# EAGLE design g5gate-wroom (EAGLE 9.6.2)
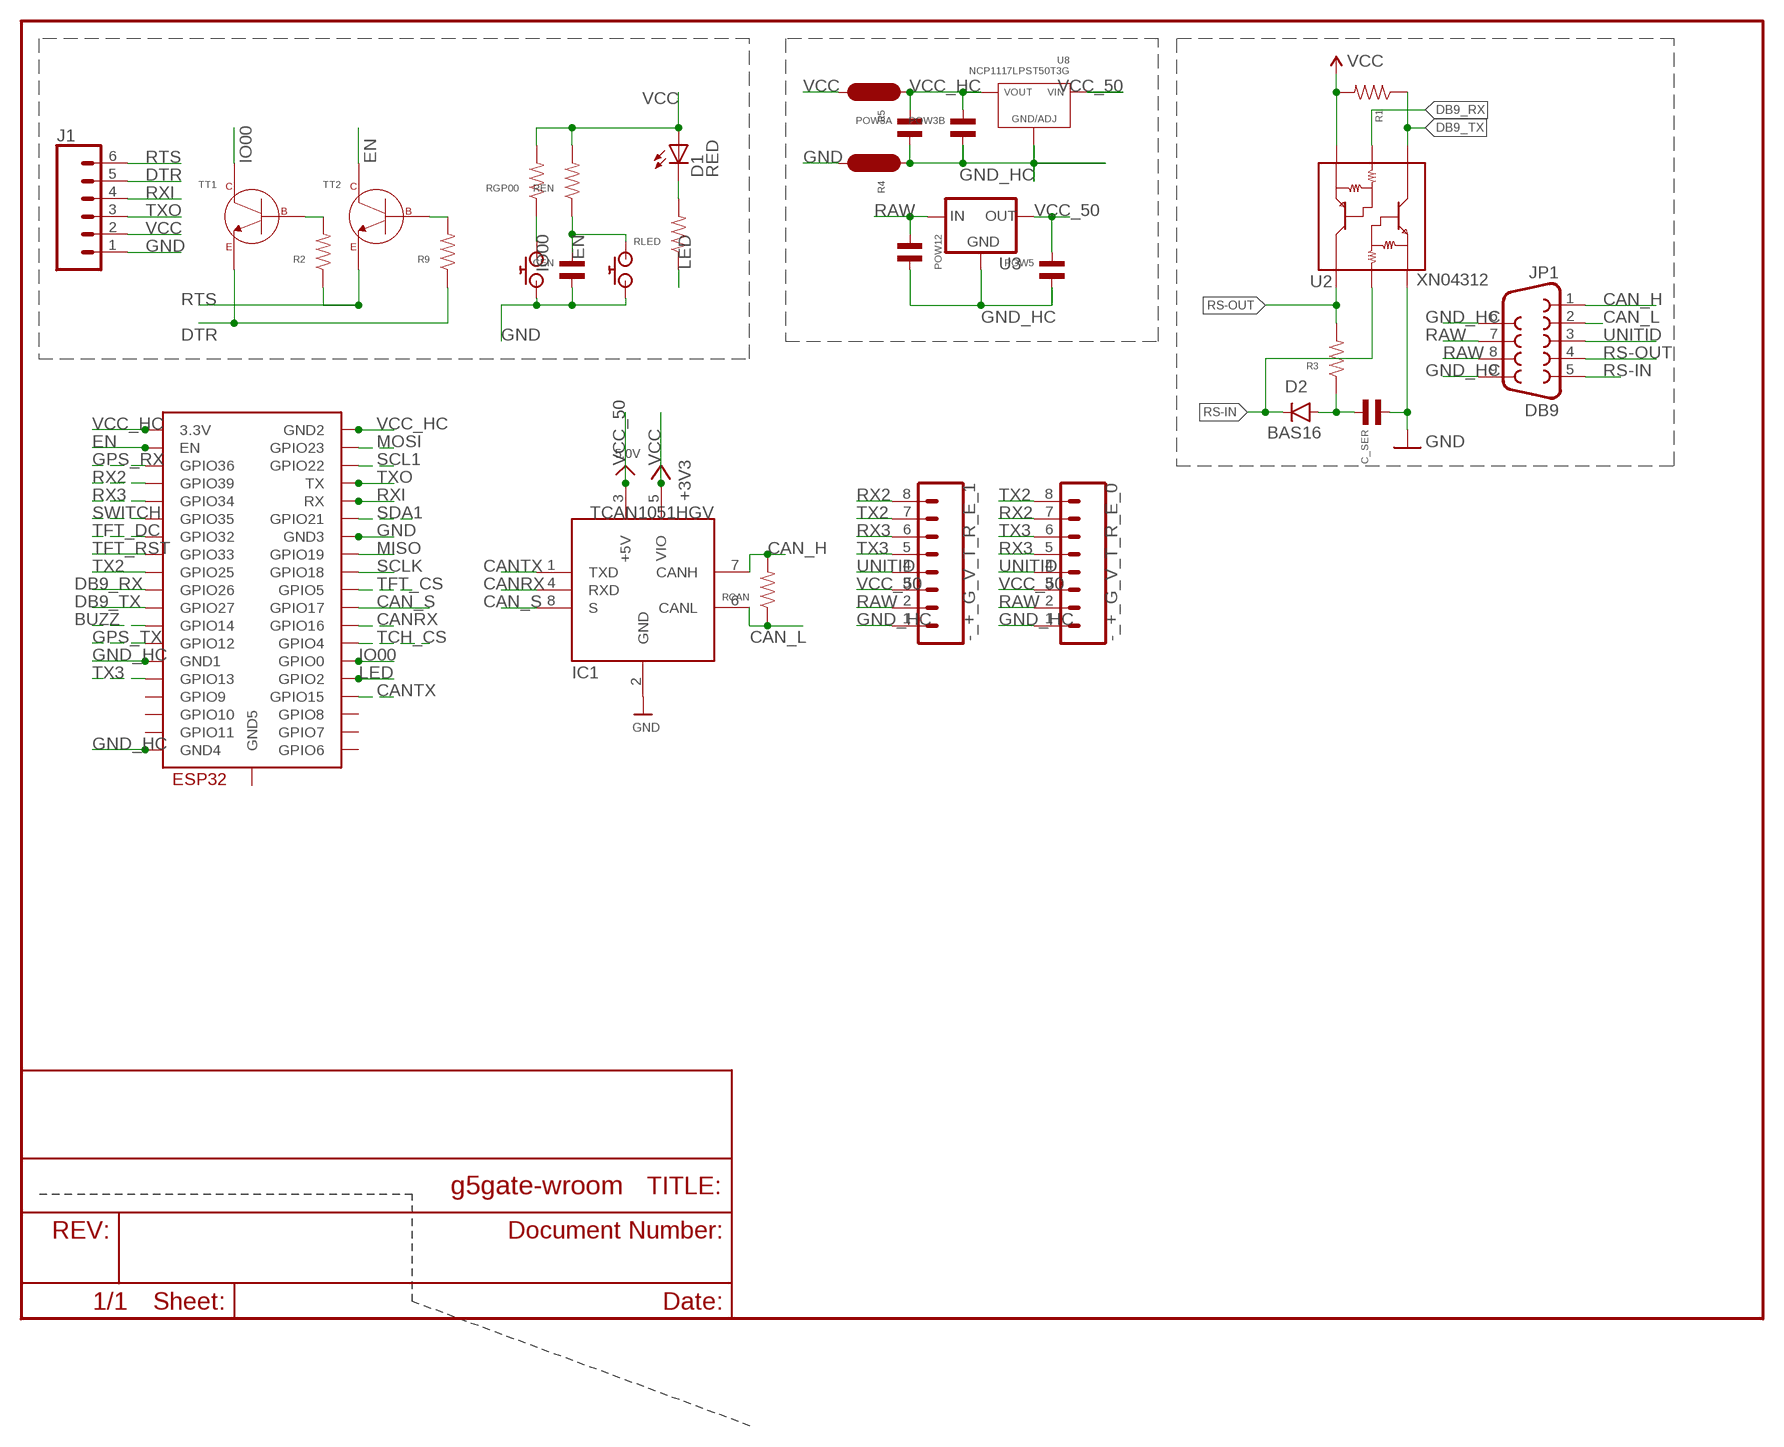
[diagram p0: schematic, sheet 1]

## Parts
-_+_G_V_T_R_E_0  MF-CON-2.54mm-01x08  M081X08  [1X08]
-_+_G_V_T_R_E_1  MF-CON-2.54mm-01x08  M081X08  [1X08]
C_SER  CAPACITOR_NP_0603  [C0603]
CEN  CAPACITOR_NP_0603  [C0603]
D1  RED  LED-RED0603  [LED-0603]
D2  BAS16  DIODEBAS16  [SOD-323]
IC1  TCAN1051HGV  CAN_TRANSCIEVER_TCAN1051V  [SOIC8_150MIL]
J1  CONN_06  [1X6-1.25MM-SMD]
JP1  DB9  DB9FEMALE  [DB9]
POW3A  CAPACITOR_NP_0603  [C0603]
POW3B  CAPACITOR_NP_0603  [C0603]
POW5  CAPACITOR_NP_0603  [C0603]
POW12  CAPACITOR_NP_0603  [C0603]
R1  RESISTOR_0603  [R0603]
R2  RESISTOR_0603  [R0603]
R3  RESISTOR_0603  [R0603]
R4  JUMPER  [R0603_JMP]
R5  JUMPER  [R0603_JMP]
R9  RESISTOR_0603  [R0603]
RCAN  RESISTOR_0603  [R0603]
REN  RESISTOR_0603  [R0603]
RGP00  RESISTOR_0603  [R0603]
RLED  RESISTOR_0603  [R0603]
TT1  MF-DSC-SOT233-MMBT3904  NPN_BJTMMBT3904_SOT-23-3  [SOT-23-3]
TT2  MF-DSC-SOT233-MMBT3904  NPN_BJTMMBT3904_SOT-23-3  [SOT-23-3]
U2  XN04312  XN04312SOT  [SOT23-6]
U3  V_REG_78XXSINK  [TO220-IGO]
U8  NCP1117LPST50T3G  [SOT-223-3]
U$1  AMAZON_BUTTONB2010  [C2010]
U$2  AMAZON_BUTTONB2010  [C2010]
U$3  ESP32-WROOM  [ESP32-WROOM]

## Nets
BUZZ: U$3.IO14(GPIO14)
CAN_H: IC1.7(CANH) JP1.1 RCAN.P$2
CAN_L: IC1.6(CANL) JP1.2 RCAN.P$1
CAN_S: IC1.8(S) U$3.IO17(GPIO17)
CANRX: IC1.4(RXD) U$3.IO16(GPIO16)
CANTX: IC1.1(TXD) U$3.IO15(GPIO15)
DB9_RX: U2.2(B2) U$3.IO26(GPIO26)
DB9_TX: R1.P$1 U2.1(C1) U$3.IO27(GPIO27)
DTR: J1.5 R9.P$1 TT1.P$2(EMITTER)
EN: CEN.P$1 REN.P$1 TT2.P$3(COLLECTOR) U$2.P$1 U$3.EN
GND: C_SER.P$2 CEN.P$2 IC1.2(GND) J1.1 R4.P$2 U2.6(E1) U$1.P$2 U$2.P$2 U$3.GND3
GND_HC [hc]: -_+_G_V_T_R_E_0.1 -_+_G_V_T_R_E_1.1 JP1.6 JP1.9 POW3A.P$2 POW3B.P$2 POW5.P$2 POW12.P$2 R4.P$1 U3.GND U8.P$2(GND/ADJ) U$3.GND1 U$3.GND4
GPS_RX: U$3.SENSOR_VP(GPIO36)
GPS_TX: U$3.IO12(GPIO12)
IO00: RGP00.P$1 TT1.P$3(COLLECTOR) U$1.P$1 U$3.IO0(GPIO0)
LED: RLED.P$1 U$3.IO2(GPIO2)
MISO: U$3.IO19(GPIO19)
MOSI: U$3.IO23(GPIO23)
N$2: D1.C RLED.P$2
N$3: R2.P$2 TT1.P$1(BASE)
N$4: C_SER.P$1 D2.A R3.P$1
N$6: R9.P$2 TT2.P$1(BASE)
RAW [hc]: -_+_G_V_T_R_E_0.2 -_+_G_V_T_R_E_1.2 JP1.7 JP1.8 POW12.P$1 U3.IN
RS-IN: D2.C JP1.5 U2.5(B1)
RS-OUT: JP1.4 R3.P$2 U2.4(C2)
RTS: J1.6 R2.P$1 TT2.P$2(EMITTER)
RX2: -_+_G_V_T_R_E_0.7 -_+_G_V_T_R_E_1.8 U$3.SENSOR_VN(GPIO39)
RX3: -_+_G_V_T_R_E_0.5 -_+_G_V_T_R_E_1.6 U$3.IO34(GPIO34)
RXI: J1.4 U$3.RX
SCL1: U$3.IO22(GPIO22)
SCLK: U$3.IO18(GPIO18)
SDA1: U$3.IO21(GPIO21)
SWITCH: U$3.IO35(GPIO35)
TCH_CS: U$3.IO4(GPIO4)
TFT_CS: U$3.IO5(GPIO5)
TFT_DC: U$3.IO32(GPIO32)
TFT_RST: U$3.IO33(GPIO33)
TX2: -_+_G_V_T_R_E_0.8 -_+_G_V_T_R_E_1.7 U$3.IO25(GPIO25)
TX3: -_+_G_V_T_R_E_0.6 -_+_G_V_T_R_E_1.5 U$3.IO13(GPIO13)
TXO: J1.3 U$3.TX
UNITID: -_+_G_V_T_R_E_0.4 -_+_G_V_T_R_E_1.4 JP1.3
VCC: D1.A IC1.5(VIO) J1.2 R1.P$2 R5.P$2 REN.P$2 RGP00.P$2 U2.3(E2) ; supply symbol labelled +3V3
VCC_50 [hc]: -_+_G_V_T_R_E_0.3 -_+_G_V_T_R_E_1.3 IC1.3(+5V) POW5.P$1 U3.OUT U8.P$4(VIN) ; supply symbol labelled 5.0V
VCC_HC [hc]: POW3A.P$1 POW3B.P$1 R5.P$1 U8.P$1(VOUT) U8.P$3(VOUT) U$3.3V3(3.3V) U$3.GND2
Unconnected: U$3.CLK(GPIO6) U$3.CMD(GPIO11) U$3.GND5 U$3.SD0(GPIO7) U$3.SD1(GPIO8) U$3.SD2(GPIO9) U$3.SD3(GPIO10)

## Library data of the parts
-_+_G_V_T_R_E_0 -_+_G_V_T_R_E_1 = SparkFun-Connectors:M08: Header 8 Standard 8-pin 0.1" header. Use with straight break away headers (SKU : PRT-00116), right angle break away headers (PRT-00553), swiss pins (PRT-00743), machine pins (PRT-00117), and female headers (PRT-00115).
C_SER CEN POW3A POW3B POW5 POW12 = MF_Passives:CAPACITOR_NP: Library: MF_Passives Description: Device for Non-Polarized Capacitors. Manufacture part number (MPN) can be added via Attributes. Check https://factory.macrofab.com/parts for the house parts list.; POPULATE: 1
D1 = 00jim:LED-RED: Assorted Red LEDs LilyPad 1206- DIO-09912 1206- DIO-00809 0603- DIO-00819; PROD_ID: DIO-00819
D2 = SparkFun-DiscreteSemi:DIODE: Diode These are standard reverse protection diodes and small signal diodes. SMA package can handle up to about 1A. SOD-323 can handle about 200mA. What the SOD-323 package when ordering, there are some mfgs out there that are 5-pin packages.; PROD_ID: DIO-09646; VALUE: 250mA/100V
IC1 = microbuilder:CAN_TRANSCIEVER
J1 = 00jim:CONN_06: Multi connection point. Often used as Generic Header-pin footprint for 0.1 inch spaced/style header connections On any of the 0.1 inch spaced packages, you can populate with these: Break Away Headers - Straight <https://www.sparkfun.com/products/116> (PRT-00116) Break Away Male Headers - Right Angle <https://www.sparkfun.com/products/553> (PRT-00553) Female Headers <https://www.sparkfun.com/products/115> (PRT-00115) Break Away Headers - Machine Pin <https://www.sparkfun.com/products/117> (PRT-00117) Break Away Female Headers - Swiss Machine Pin <https://www.sparkfun.com/products/743> (PRT-00743) Arduino Stackable Header - 6 Pin <https://www.sparkfun.com/products/9280> (PRT-09280) For SCREWTERMINALS and SPRING TERMINALS visit here: Screw Terimnals on SparkFun.com <https://www.sparkfun.com/search/results?term=Screw+Terminals> (5mm/3.5mm/2.54mm spacing) This device is also useful as a general connection point to wire up your design to another part of your project. Our various solder wires solder well into these plated through hole pads. Hook-Up Wire - Assortment (Stranded, 22 AWG) <https://www.sparkfun.com/products/11375> (PRT-11375) Hook-Up Wire - Assortment (Solid Core, 22 AWG) <https://www.sparkfun.com/products/11367> (PRT-11367) View the entire wire category on our website here <https://www.sparkfun.com/categories/141>
JP1 = SparkFun-Connectors:DB9: DB9 Connector Standard DB9 (D-Sub 9) serial connector. Can be used for CAN bus as well as RS485 and RS232. Footprint production proven. Spark Fun Electronics SKU : PRT-00429; PROD_ID: CONN-08194
R1-R3 R9 RCAN REN RGP00 RLED = 00jim:RESISTOR: Library: MF_Passives Description: Device for Resistors. Manufacture part number (MPN), Voltage, Tolerance, and Wattage Rating can be added via Attributes. Check https://factory.macrofab.com/parts for the house parts list.; POPULATE: 1
R4 R5 = 00jim:JUMPER: Library: MF_Passives Description: Device for Resistors. Manufacture part number (MPN), Voltage, Tolerance, and Wattage Rating can be added via Attributes. Check https://factory.macrofab.com/parts for the house parts list.
TT1 TT2 = MF_Discrete_Semiconductor:NPN_BJT: Library: MF_Discrete_Semiconductor Description: Device for Single NPN BJT Transistors. Manufacture part number (MFG#) can be added via Attributes.; HOUSEPART: YES; MPN: MF-DSC-SOT233-MMBT3904; POPULATE: 1; URL: https://factory.macrofab.com/part/MF-DSC-SOT233-MMBT3904
U2 = SparkFun-DiscreteSemi:XN04312: NPN/PNP Transistor Array Handy dandy transistor array for level shifting and inverting signals. Spark Fun Electronics SKU : COM-00588; PROD_ID: TRANS-00816
U3 = SparkFun-IC-Power:V_REG_78XX: Voltage Regulator Standard 78xx regulator. IGO (Input Ground Output). Spark Fun Electronics SKU : COM-00107
U8 = MF_IC_Power:NCP1117LP: Manufacturer Part #: NCP1117LP Manufacturer: ON Semiconductor Description: LDO Voltage Regulators; HOUSEPART: NO; MPN: NCP1117LPST50T3G; POPULATE: 1; URL: http://www.onsemi.com/pub_link/Collateral/NCP1117LP-D.PDF
U$1 U$2 = 00jim:AMAZON_BUTTON
U$3 = ESP32:ESP32-WROOM

## Net classes
0 default: width 0.229 mm
1 vcc: width 0.254 mm
3 hc: width 0.508 mm

## Board
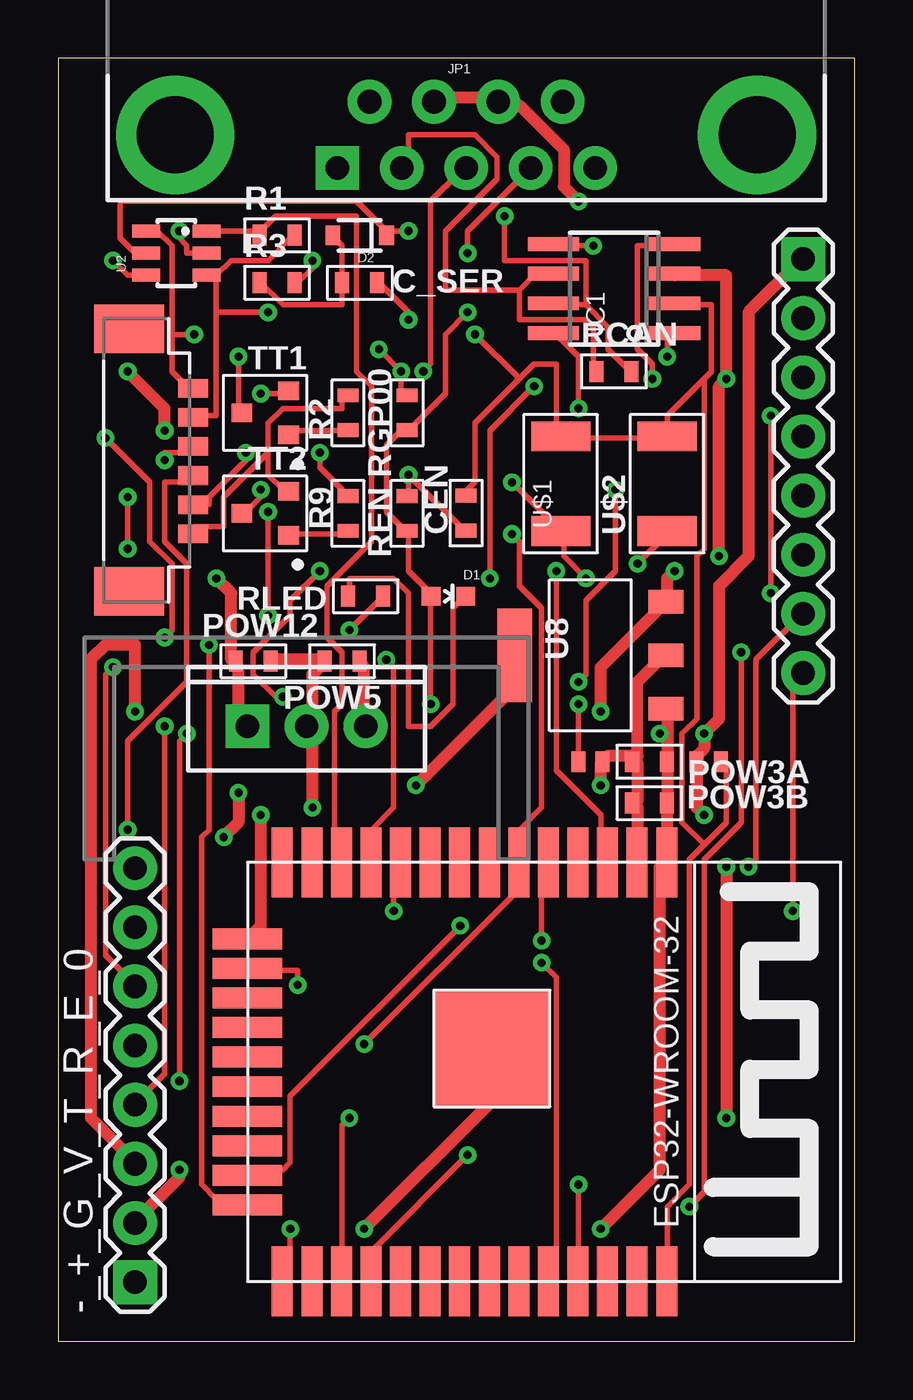
[diagram p1: board, top side]
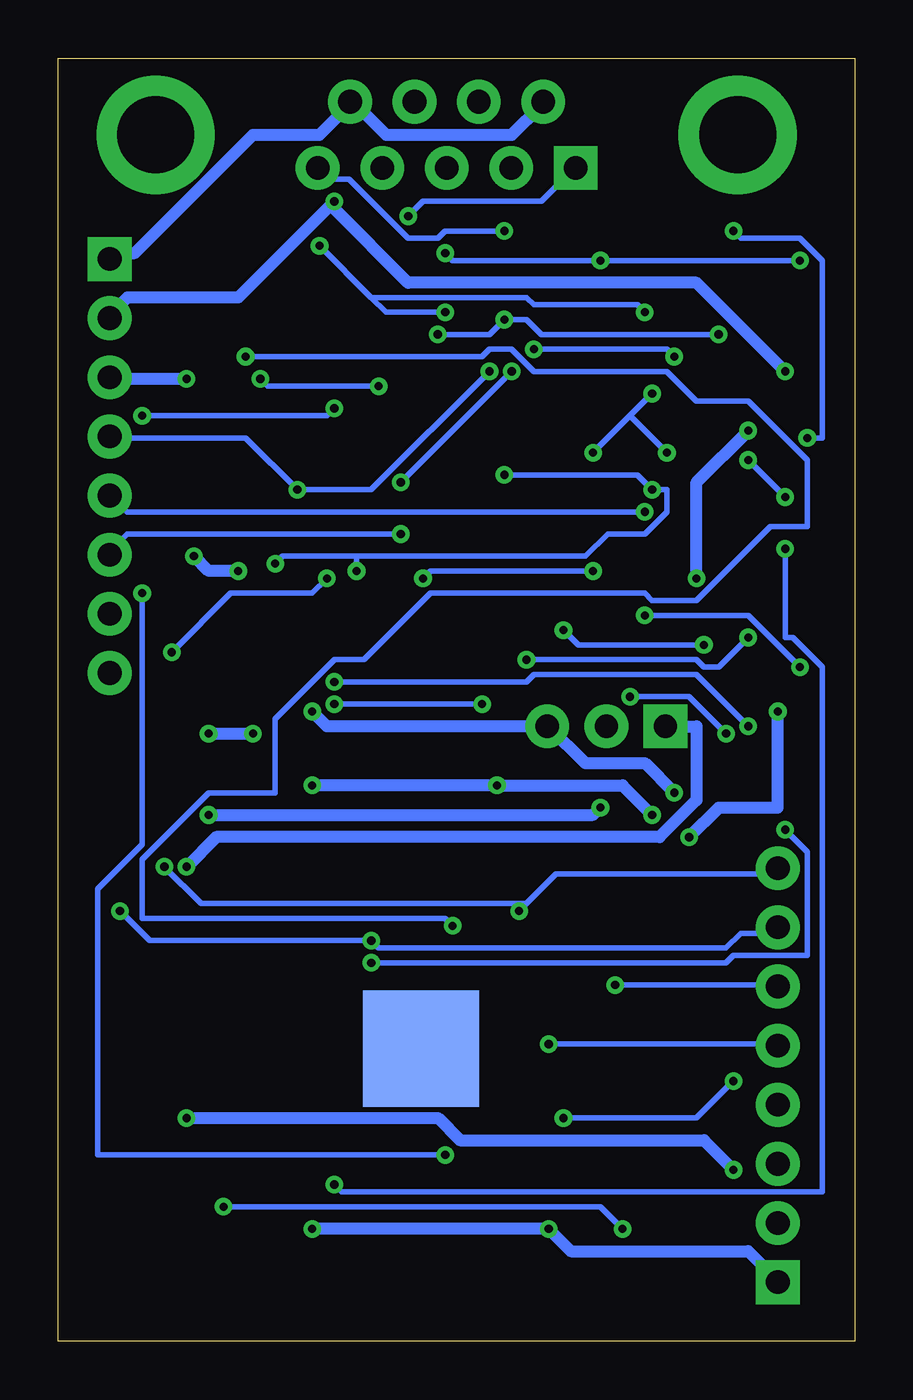
[diagram p2: board, bottom side, seen from below]

Size 34.21 x 55.11 mm. Coordinates in mm from the lower left corner, seen from the top.
Outline: 0,0 34.21,0 34.21,55.11 0,55.11 0,0
Copper layers (1*16): Top 0.035mm / dielectric 1.5mm / Bottom 0.035mm
Design rules "default *": minimum track width 6mil, minimum drill 0.35mm, track to track 6mil, track to pad 6mil, pad to pad 6mil, via to via 6mil, smd to smd 6mil, copper to edge 40mil, drill to drill 6mil, minimum pad ring 10mil, minimum via ring 8mil, stop-mask expansion 4mil, vias tented up to drill 30mil, thermal gap 10mil

### Footprints (pad centres in the part's own frame; a part is rotated, then mirrored left to right if it is on the bottom)
1X08 = drill 1.016 pad 1.88 square: 1 0,0 | drill 1.016 pad 1.88: 2 2.54,0; 3 5.08,0; 4 7.62,0; 5 10.16,0; 6 12.7,0; 7 15.24,0; 8 17.78,0
C0603 = smd 0.6 x 0.9: P$1 -0.75,0; P$2 0.75,0
LED-0603 = smd 0.8 x 0.8: A 0,-0.75; C 0,0.75
SOD-323 = smd 0.63 x 0.83: A 1.15,0; C -1.15,0
SOIC8_150MIL = smd 0.6 x 2.2: 1 -1.905,-2.6; 2 -0.635,-2.6; 3 0.635,-2.6; 4 1.905,-2.6; 5 1.905,2.6; 6 0.635,2.6; 7 -0.635,2.6; 8 -1.905,2.6
1X6-1.25MM-SMD = smd 0.8 x 1.3: 1 -3.085,1.48; 2 -1.835,1.48; 3 -0.585,1.48; 4 0.665,1.48; 5 1.915,1.48; 6 3.165,1.48 | smd 2.1 x 3: NC1 -5.635,-1.27; NC2 5.635,-1.27
DB9 = drill 1.016 pad 1.88 square: 1 -5.54,-1.42 | drill 1.016 pad 1.88: 2 -2.77,-1.42; 3 0,-1.42; 4 2.77,-1.42; 5 5.54,-1.42; 6 -4.15,1.42; 7 -1.38,1.42; 8 1.38,1.42; 9 4.15,1.42 | drill 3.302 pad 5.08: G1 -12.5,0; G2 12.5,0
R0603 = smd 0.6 x 0.9: P$1 -0.75,0; P$2 0.75,0
R0603_JMP = smd 0.6 x 0.9: P$1 0.52,0; P$2 -0.52,0
SOT-23-3 = smd 0.9 x 0.8: P$1 -1,0.95; P$2 -1,-0.95; P$3 1,0
SOT23-6 = smd 0.55 x 1.2: 1 0.95,-1.3; 2 0,-1.3; 3 -0.95,-1.3; 4 -0.95,1.3; 5 0,1.3; 6 0.95,1.3
TO220-IGO = drill 1 pad 1.88: GND 0,0; OUT 2.54,0 | drill 1 pad 1.88 square: IN -2.54,0
SOT-223-3 = smd 1.5 x 4: P$1 3.25,0 | smd 1.5 x 1: P$2 -3.25,2.3; P$3 -3.25,0; P$4 -3.25,-2.3
C2010 = smd 1.27 x 2.54: P$1 -2.032,0; P$2 2.032,0
ESP32-WROOM = smd 3 x 0.9: 3V3 0,16.74; EN 0,15.47; GND1 0,18.01; GND3 18,18.01; IO0 18,1.5; IO4 18,2.77; IO5 18,6.58; IO12 0,1.5; IO14 0,2.77; IO16 18,4.04; IO17 18,5.31; IO18 18,7.85; IO19 18,9.12; IO21 18,11.66; IO22 18,15.47; IO23 18,16.74; IO25 0,6.58; IO26 0,5.31; IO27 0,4.04; IO32 0,9.12; IO33 0,7.85; IO34 0,11.66; IO35 0,10.39; NC 18,10.39; RX 18,12.93; SENSOR_VN 0,12.93; SENSOR_VP 0,14.2; TX 18,14.2 | smd 0.9 x 3: CLK 9.635,0; CMD 8.365,0; GND2 3.285,0; IO2 14.715,0; IO13 4.555,0; IO15 13.445,0; SD0 10.905,0; SD1 12.175,0; SD2 5.825,0; SD3 7.095,0 | smd 5 x 5: GND4 8,10.5 | smd 5 x 5 bottom: GND5 8,10.5

### Placement (x,y rotation side)
-_+_G_V_T_R_E_0  3.3,2.54 90 top
-_+_G_V_T_R_E_1  32,46.48 270 top
C_SER  12.95,45.47 0 top
CEN  17.53,35.57 90 top
D1  16.76,32 270 top
D2  12.95,47.5 180 top
IC1  23.88,45.21 90 top
J1  4.32,37.85 270 top
JP1  17.53,51.82 0 top
POW3A  25.4,24.89 0 top
POW3B  25.4,23.11 0 top
POW5  12.19,29.21 180 top
POW12  8.38,29.21 0 top
R1  9.4,47.5 0 top
R2  12.45,39.88 270 top
R3  9.4,45.47 0 top
R4  27.94,24.89 180 top
R5  22.86,24.89 0 top
R9  12.45,35.56 270 top
RCAN  23.88,41.66 0 top
REN  14.99,35.56 270 top
RGP00  14.99,39.88 270 top
RLED  13.21,32 180 top
TT1  8.89,39.88 180 top
TT2  8.89,35.56 180 top
U2  5.08,46.74 90 top
U3  10.67,26.42 0 top
U8  22.86,29.46 180 top
U$1  21.59,36.83 90 top
U$2  26.16,36.83 90 top
U$3  8.13,20.57 270 top

### Tracks (layer width: path | path; a pad name or v marks a point on that pad's centre or on a via)
CAN_H  (via drill 0.35)
  Top 0.229: 22.67,44.51 23.62,43.56 23.62,42.61 24.57,41.66 RCAN.P$2 | 22.67,44.51 21.4,44.51 IC1.7 | 22.67,44.51 22.67,46.42 19.18,46.42 v19.18,48.32
  Bottom 0.229: v19.18,48.32 18.54,48.96 13.46,48.96 12.19,50.23 JP1.1
CAN_L
  Top 0.229: 19.81,45.15 19.81,43.88 22.67,43.88 22.99,43.56 22.99,41.66 RCAN.P$1 | 19.81,45.15 20.45,45.78 21.08,45.78 IC1.6 | 19.81,45.15 16.64,45.15 16.64,47.69 18.86,49.91 18.86,50.86 17.91,51.82 15.05,51.82 15.05,50.55 JP1.2
CAN_S  (via drill 0.35)
  Top 0.229: v22.35,40.07 22.35,42.29 21.4,43.24 IC1.8 | v30.61,32.13 v30.61,39.75 | v17.59,8 13.46,3.87 13.46,2.6 U$3.IO17
  Bottom 0.229: v22.35,40.07 22.67,39.75 v30.61,39.75 | v30.61,32.13 30.61,21.34 32.51,19.43 32.51,8 v17.59,8
CANRX  (via drill 0.35)
  Top 0.229: v25.53,41.34 25.53,41.97 24.89,42.61 24.89,47.05 26.16,47.05 IC1.4 | v20.45,41.02 18.54,39.12 v18.54,32.77 | v11.24,33.08 9.97,31.81 9.97,31.18 8.38,29.59 8.38,28.64 9.33,27.69 v9.65,27.69 | v5.52,26.1 5.21,25.78 v5.21,11.18 | v12.51,9.59 12.19,9.27 12.19,2.6 U$3.IO16
  Bottom 0.229: v25.53,41.34 25.21,41.02 v20.45,41.02 | v18.54,32.77 18.23,33.08 v11.24,33.08 | v9.65,27.69 7.11,27.69 v5.52,26.1 | v5.21,11.18 6.79,9.59 v12.51,9.59
CANTX  (via drill 0.35)
  Top 0.229: v26.16,42.29 26.16,43.24 IC1.1 | v17.27,17.84 9.97,10.54 9.97,7.68 9.65,7.37 8.38,7.37 U$3.IO15
  Bottom 0.229: v26.16,42.29 16,42.29 15.68,42.61 14.73,42.61 13.78,41.66 8.06,41.66 6.79,40.39 4.57,40.39 2.03,37.85 2.03,34.99 3.62,34.99 6.79,31.81 8.7,31.81 9.02,32.13 18.23,32.13 21.08,29.27 22.35,29.27 24.89,26.73 24.89,23.56 27.75,23.56 30.61,20.7 30.61,18.16 17.59,18.16 v17.27,17.84
DB9_RX  (via drill 0.35)
  Top 0.229: U2.2 5.52,46.74 5.52,47.05 5.21,47.37 v5.21,47.69 | v2.03,38.8 3.94,36.89 3.94,34.35 4.89,33.4 4.89,30.54 v4.57,30.23 | v14.1,29.27 14.41,28.96 14.41,22.92 13.46,21.97 13.46,20.7 U$3.IO26
  Bottom 0.229: v5.21,47.69 4.89,47.37 2.35,47.37 1.4,46.42 1.4,38.8 v2.03,38.8 | v4.57,30.23 5.84,28.96 6.48,28.96 6.79,29.27 v14.1,29.27
DB9_TX
  Top 0.229: U2.1 6.48,47.69 8.38,47.69 R1.P$1 8.7,47.69 9.33,48.32 12.83,48.32 12.83,41.66 13.46,41.02 13.46,34.35 11.56,32.45 11.56,30.23 12.19,29.59 12.19,27.37 11.88,27.05 11.88,20.7 U$3.IO27
DTR  (via drill 0.35)
  Top 0.229: v11.24,38.16 11.24,37.53 12.19,36.58 R9.P$1 | v8.7,40.7 9.65,40.7 TT1.P$2 | v8.06,38.16 8.06,37.85 6.48,36.26 6.48,35.94 5.84,35.94 J1.5
  Bottom 0.229: v8.7,40.7 9.65,39.75 | 9.65,39.75 v11.24,38.16 | 9.65,39.75 v8.06,38.16
EN  (via drill 0.35)
  Top 0.229: v8.7,36.58 8.7,36.26 8.06,35.62 TT2.P$3 | REN.P$1 15.05,36.58 v15.05,37.21 17.27,34.99 CEN.P$1 | v24.89,33.4 26.16,34.67 U$2.P$1 | v21.4,33.08 21.4,24.51 23.3,22.61 23.3,20.7 U$3.EN
  Bottom 0.229: v15.05,37.21 9.33,37.21 v8.7,36.58 8.06,36.58 8.06,35.62 9.02,34.67 10.61,34.67 11.56,33.72 21.4,33.72 | v24.89,33.4 24.57,33.72 21.4,33.72 | 21.4,33.72 v21.4,33.08
GND  (via drill 0.35)
  Top 0.229: 27.75,21.34 27.11,20.7 27.11,6.73 26.16,5.78 26.16,2.6 U$3.GND3 | 27.75,21.34 28.7,22.29 28.7,24.83 R4.P$2 | 27.75,41.34 26.16,39.75 U$2.P$2 26.16,38.8 21.72,38.8 U$1.P$2 21.4,39.12 21.4,41.97 20.45,41.97 19.81,41.34 | 27.75,41.34 28.07,41.66 28.07,44.51 26.48,44.51 IC1.2 | 4.89,43.24 4.89,41.66 5.52,41.02 J1.1 | 4.89,43.24 4.89,47.05 4.25,47.69 3.94,47.69 U2.6 | 19.81,41.34 17.91,39.43 17.91,36.89 17.59,36.58 CEN.P$2 | v15.05,43.88 15.05,44.2 13.78,45.47 C_SER.P$2 | 19.81,41.34 v17.91,43.24 | v5.84,43.24 4.89,43.24 | 27.75,21.34 26.8,22.29 26.8,26.1 27.43,26.73 27.43,33.72 27.75,34.04 27.75,41.34
  Bottom 0.229: v17.91,43.24 15.68,43.24 v15.05,43.88 14.1,43.88 13.46,43.24 v5.84,43.24
GND_HC  (via drill 0.35)
  Top 0.508: 26.16,26.1 26.16,27.05 U8.P$2 | 26.16,26.1 26.16,25.15 POW3A.P$2 26.16,24.83 26.16,23.24 POW3B.P$2 26.16,22.92 26.16,20.7 U$3.GND1 25.84,20.38 25.84,7.37 v23.3,4.83 | v13.14,4.83 18.54,10.22 18.54,12.45 U$3.GND4 | POW12.P$2 9.33,29.27 11.24,29.27 POW5.P$2 11.24,28.96 10.92,28.64 10.92,26.42 | -_+_G_V_T_R_E_1.1 31.88,46.42 29.66,44.2 29.66,33.72 28.38,32.45 28.38,26.73 v27.75,26.1 27.75,25.46 27.43,25.15 R4.P$1 27.43,24.83 27.43,22.92 v27.75,22.61 | v10.92,22.92 10.92,26.42 | 10.92,26.42 U3.GND | v25.84,26.1 26.16,26.1
  Bottom 0.508: -_+_G_V_T_R_E_0.1 3.3,2.6 4.57,3.87 12.19,3.87 v13.14,4.83 v23.3,4.83 | JP1.6 13.46,53.09 14.73,51.82 20.13,51.82 21.4,53.09 JP1.9 21.72,53.09 22.99,51.82 25.84,51.82 30.93,46.74 31.88,46.74 -_+_G_V_T_R_E_1.1 | v10.92,22.92 11.24,22.61 v27.75,22.61 | v27.75,26.1 v25.84,26.1
IO00  (via drill 0.35)
  Top 0.229: v7.75,42.29 7.75,40.07 TT1.P$3 | v13.78,42.61 v14.73,41.66 14.73,40.7 RGP00.P$1 | v19.5,36.89 U$1.P$1 21.72,34.67 21.72,33.72 v22.67,32.77 | v9.97,4.83 9.97,2.92 9.65,2.6 U$3.IO0 | v27.11,5.78 27.75,6.41 27.75,20.7 29.34,22.29 v29.34,29.59
  Bottom 0.229: v7.75,42.29 8.06,42.61 v13.78,42.61 | v14.73,41.66 v19.5,36.89 | v9.97,4.83 10.92,5.78 v27.11,5.78 | v29.34,29.59 26.8,32.13 23.3,32.13 v22.67,32.77
LED  (via drill 0.35)
  Top 0.229: v12.51,30.54 13.78,31.81 RLED.P$1 | v6.48,29.91 6.48,21.97 6.16,21.65 6.16,6.73 6.79,6.1 8.06,6.1 U$3.IO2
  Bottom 0.229: v12.51,30.54 11.88,29.91 v6.48,29.91
N$2
  Top 0.229: D1.C 17.27,31.81 16.95,31.5 16.95,27.37 16,26.42 15.05,26.42 15.05,32.13 14.41,32.77 12.51,32.77 12.51,32.13 RLED.P$2
N$3
  Top 0.229: TT1.P$1 9.97,39.12 12.19,39.12 R2.P$2
N$4
  Top 0.229: C_SER.P$1 12.19,47.05 11.88,47.37 D2.A | C_SER.P$1 12.19,44.51 9.65,44.51 8.7,45.47 R3.P$1 | C_SER.P$1
N$6
  Top 0.229: TT2.P$1 9.97,34.67 12.19,34.67 R9.P$2
RAW  (via drill 0.35)
  Top 0.508: JP1.7 16.32,53.4 18.86,53.4 JP1.8 19.18,53.09 19.81,53.09 21.72,51.18 21.72,49.59 v22.35,48.96 | U3.IN 8.06,26.42 7.75,26.73 7.75,28.96 POW12.P$1 7.43,29.27 7.43,32.13 v6.79,32.77 | v5.21,7.37 5.21,7.05 3.3,5.14 -_+_G_V_T_R_E_0.2 | v28.7,20.38 v28.7,9.59 | v2.98,41.66 4.57,40.07 v4.57,39.12
  Bottom 0.508: -_+_G_V_T_R_E_1.2 31.88,44.2 31.24,44.83 26.48,44.83 v22.35,48.96 22.35,48.64 19.18,45.47 6.79,45.47 v2.98,41.66 | v5.21,7.37 6.48,8.64 16.95,8.64 17.91,9.59 v28.7,9.59 | v28.7,20.38 27.43,21.65 8.38,21.65 6.79,23.24 6.79,26.42 U3.IN | v4.57,39.12 6.79,36.89 v6.79,32.77
RS-IN  (via drill 0.35)
  Top 0.229: U2.5 3.3,46.74 2.67,47.37 2.67,48.96 12.83,48.96 14.1,47.69 D2.C 14.41,47.69 v15.05,47.69
  Bottom 0.229: v15.05,47.69 17.59,47.69 17.91,47.37 19.18,47.37 21.72,49.91 22.67,49.91 22.99,50.23 JP1.5
RS-OUT  (via drill 0.35)
  Top 0.229: v10.92,46.42 10.92,46.1 10.29,45.47 R3.P$2 | v2.35,46.42 2.98,45.78 3.62,45.78 U2.4 | v17.59,46.74 17.59,47.69 20.13,50.23 JP1.4
  Bottom 0.229: v2.35,46.42 v10.92,46.42 17.27,46.42 v17.59,46.74
RTS
  Top 0.229: 9.02,38.16 9.02,39.43 9.65,40.07 12.19,40.07 12.19,40.39 R2.P$1 | 9.02,38.16 9.02,37.21 9.65,36.58 TT2.P$2 | 9.02,38.16 7.11,36.26 7.11,34.99 5.84,34.99 J1.6
RX2  (via drill 0.35)
  Top 0.229: v20.77,17.21 20.77,20.38 U$3.SENSOR_VN | v31.56,18.48 31.56,28.32 31.88,28.64 -_+_G_V_T_R_E_1.8
  Bottom 0.229: -_+_G_V_T_R_E_0.7 3.3,17.53 4.89,17.53 5.52,16.89 20.45,16.89 v20.77,17.21 30.29,17.21 v31.56,18.48
RX3  (via drill 0.35)
  Top 0.229: v13.14,12.76 19.5,19.11 19.5,20.38 U$3.IO34 19.81,20.7 19.81,21.97 20.77,22.92 20.77,31.5 19.81,32.45 19.81,34.35 v19.5,34.67
  Bottom 0.229: v13.14,12.76 3.3,12.76 -_+_G_V_T_R_E_0.5 | v19.5,34.67 31.24,34.67 31.88,34.04 -_+_G_V_T_R_E_1.6
RXI  (via drill 0.35)
  Top 0.229: v2.98,21.97 2.98,25.78 5.52,28.32 5.52,33.4 4.57,34.35 4.57,36.89 5.52,36.89 J1.4 | v20.77,16.26 21.4,15.62 21.4,2.92 21.08,2.6 U$3.RX
  Bottom 0.229: v2.98,21.97 2.03,21.02 2.03,16.57 5.21,16.57 5.52,16.26 v20.77,16.26
TX2  (via drill 0.35)
  Top 0.229: v14.41,18.48 14.41,20.38 U$3.IO25 | v29.66,20.38 29.97,20.7 29.97,29.27 31.88,31.18 -_+_G_V_T_R_E_1.7
  Bottom 0.229: 14.1,18.8 12.83,20.07 3.3,20.07 -_+_G_V_T_R_E_0.8 | 14.1,18.8 v14.41,18.48 | v29.66,20.38 28.07,18.8 14.1,18.8
TX3  (via drill 0.35)
  Top 0.229: v10.29,15.3 10.29,15.94 8.38,15.94 U$3.IO13 | v9.02,31.18 v9.02,35.62 | v2.35,28.96 2.03,28.64 2.03,16.57 3.3,15.3 -_+_G_V_T_R_E_0.6
  Bottom 0.229: v10.29,15.3 3.3,15.3 -_+_G_V_T_R_E_0.6 | v9.02,35.62 31.24,35.62 31.88,36.26 -_+_G_V_T_R_E_1.5 | v9.02,31.18 4.57,31.18 v2.35,28.96
TXO  (via drill 0.35)
  Top 0.229: v4.57,37.85 4.57,38.16 5.52,38.16 J1.3 | v2.98,34.04 v2.98,36.26 | v22.35,6.73 22.35,2.6 U$3.TX
  Bottom 0.229: v2.98,36.26 v4.57,37.85 | v2.98,34.04 2.98,30.23 2.67,30.23 1.4,28.96 1.4,6.41 22.04,6.41 v22.35,6.73
UNITID  (via drill 0.35)
  Top 0.229: v4.57,26.42 4.57,11.49 3.3,10.22 -_+_G_V_T_R_E_0.4 | v22.35,28.32 22.67,28.64 22.67,31.81 23.94,33.08 v23.94,36.58 | v15.68,41.66 16,41.97 16,48.96 17.27,50.23 JP1.3
  Bottom 0.229: v4.57,26.42 6.79,28.64 13.78,28.64 14.1,28.32 v22.35,28.32 | -_+_G_V_T_R_E_1.4 31.88,38.8 26.16,38.8 v23.94,36.58 20.77,36.58 v15.68,41.66
VCC  (via drill 0.35)
  Top 0.229: 6.79,45.78 7.43,46.42 9.02,46.42 9.97,47.37 R1.P$2 | 6.79,45.78 6.48,45.78 U2.3 6.79,45.78 | 6.79,45.78 6.79,44.2 | 6.79,44.2 6.79,39.75 5.84,39.75 J1.2 | v22.35,27.37 22.35,25.15 R5.P$2 | v16,27.37 16,31.81 D1.A 16,32.13 15.05,33.08 15.05,34.67 REN.P$2 14.73,34.99 14.1,35.62 14.1,38.48 14.73,39.12 RGP00.P$2 15.05,39.12 16.64,40.7 16.64,43.24 v17.59,44.2 | v22.99,47.05 21.4,47.05 IC1.5 | v9.02,44.2 6.79,44.2
  Bottom 0.229: v16,27.37 v22.35,27.37 | 20.77,44.83 20.13,44.2 v17.59,44.2 | 20.77,44.83 v22.99,47.05 | v9.02,44.2 9.33,44.51 13.78,44.51 14.1,44.83 20.77,44.83
VCC_50  (via drill 0.35)
  Top 0.508: IC1.3 26.48,45.78 28.7,45.78 v28.7,41.34 28.38,41.02 v28.38,33.72 | POW5.P$1 13.14,28.96 13.14,26.42 U3.OUT | v23.3,27.05 23.3,28.96 25.84,31.5 U8.P$4 26.16,31.81 26.16,32.77 v26.48,33.08 | v3.3,27.05 3.3,29.91 2.03,29.91 1.4,29.27 1.4,9.59 3.3,7.68 -_+_G_V_T_R_E_0.3 | v7.11,21.65 7.75,22.29 v7.75,23.56
  Bottom 0.508: v28.7,41.34 31.88,41.34 -_+_G_V_T_R_E_1.3 | v23.3,27.05 22.67,26.42 U3.OUT 13.14,26.42 11.56,24.83 9.02,24.83 v7.75,23.56 | v3.3,27.05 3.3,22.92 5.84,22.92 v7.11,21.65 | v28.38,33.72 27.75,33.08 v26.48,33.08
VCC_HC  (via drill 0.35)
  Top 0.508: POW3A.P$1 24.89,24.83 24.89,23.24 POW3B.P$1 24.89,22.92 24.89,20.7 U$3.3V3 | POW3A.P$1 24.57,25.15 23.62,25.15 R5.P$1 23.3,24.83 v23.3,23.88 | U8.P$3 25.84,29.27 24.89,28.32 24.89,25.15 POW3A.P$1 | v8.7,22.61 8.7,17.84 8.38,17.53 U$3.GND2 | v15.37,23.88 19.5,28 19.5,29.27 U8.P$1
  Bottom 0.508: v8.7,22.61 9.97,23.88 v15.37,23.88 v23.3,23.88